# Altium schematic sheet Power Components.SchDoc
size A
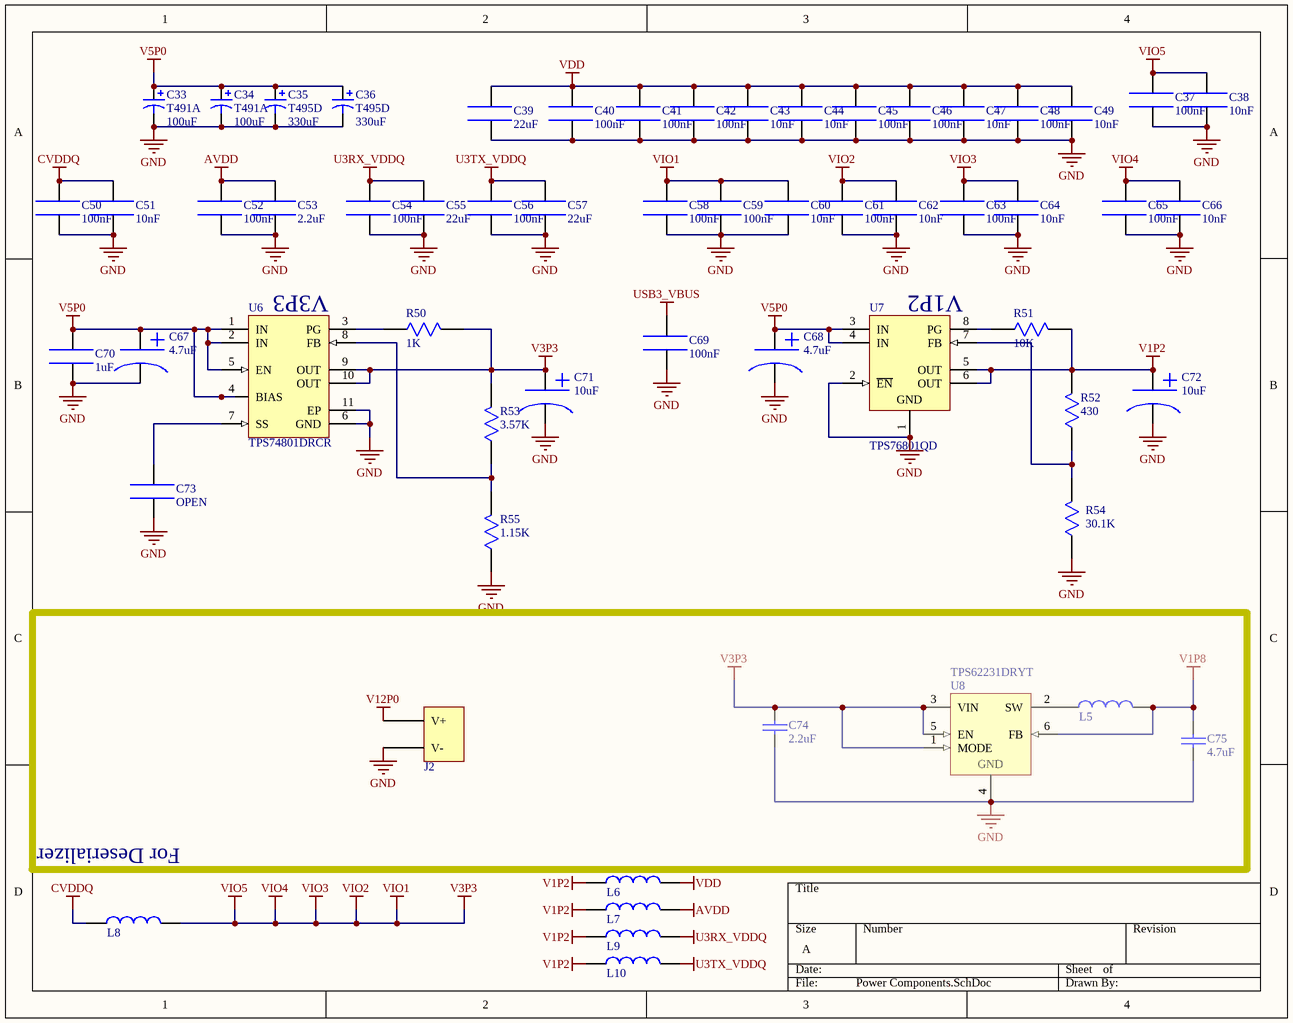
[diagram p0: Power Components.SchDoc]

## Parts
C33  T491A  value 100uF  [A]
C34  T491A  value 100uF  [A]
C35  T495D  value 330uF  [D]
C36  T495D  value 330uF  [D]
C37  value 100nF  [SMD Capacitor 0603]  (hidden comment: Capacitor)
C38  value 10nF  [SMD Capacitor 0603]  (hidden comment: Capacitor)
C39  value 22uF  [SMD Capacitor 0603]  (hidden comment: Capacitor)
C40  value 100nF  [SMD Capacitor 0603]  (hidden comment: Capacitor)
C41  value 100nF  [SMD Capacitor 0603]  (hidden comment: Capacitor)
C42  value 100nF  [SMD Capacitor 0603]  (hidden comment: Capacitor)
C43  value 10nF  [SMD Capacitor 0603]  (hidden comment: Capacitor)
C44  value 10nF  [SMD Capacitor 0603]  (hidden comment: Capacitor)
C45  value 100nF  [SMD Capacitor 0603]  (hidden comment: Capacitor)
C46  value 100nF  [SMD Capacitor 0603]  (hidden comment: Capacitor)
C47  value 10nF  [SMD Capacitor 0603]  (hidden comment: Capacitor)
C48  value 100nF  [SMD Capacitor 0603]  (hidden comment: Capacitor)
C49  value 10nF  [SMD Capacitor 0603]  (hidden comment: Capacitor)
C50  value 100nF  [SMD Capacitor 0603]  (hidden comment: Capacitor)
C51  value 10nF  [SMD Capacitor 0603]  (hidden comment: Capacitor)
C52  value 100nF  [SMD Capacitor 0603]  (hidden comment: Capacitor)
C53  value 2.2uF  [SMD Capacitor 0603]  (hidden comment: Capacitor)
C54  value 100nF  [SMD Capacitor 0603]  (hidden comment: Capacitor)
C55  value 22uF  [SMD Capacitor 0603]  (hidden comment: Capacitor)
C56  value 100nF  [SMD Capacitor 0603]  (hidden comment: Capacitor)
C57  value 22uF  [SMD Capacitor 0603]  (hidden comment: Capacitor)
C58  value 100nF  [SMD Capacitor 0603]  (hidden comment: Capacitor)
C59  value 100nF  [SMD Capacitor 0603]  (hidden comment: Capacitor)
C60  value 10nF  [SMD Capacitor 0603]  (hidden comment: Capacitor)
C61  value 100nF  [SMD Capacitor 0603]  (hidden comment: Capacitor)
C62  value 10nF  [SMD Capacitor 0603]  (hidden comment: Capacitor)
C63  value 100nF  [SMD Capacitor 0603]  (hidden comment: Capacitor)
C64  value 10nF  [SMD Capacitor 0603]  (hidden comment: Capacitor)
C65  value 100nF  [SMD Capacitor 0603]  (hidden comment: Capacitor)
C66  value 10nF  [SMD Capacitor 0603]  (hidden comment: Capacitor)
C67  value 4.7uF  [Capacitor Polarized 0603]  (hidden comment: Capacitor Polarized)
C68  value 4.7uF  [Capacitor Polarized 0603]  (hidden comment: Capacitor Polarized)
C69  value 100nF  [SMD Capacitor 0603]  (hidden comment: Capacitor)
C70  value 1uF  [SMD Capacitor 0603]  (hidden comment: Capacitor)
C71  value 10uF  [Capacitor Polarized 0603]  (hidden comment: Capacitor Polarized)
C72  value 10uF  [Capacitor Polarized 0603]  (hidden comment: Capacitor Polarized)
C73  value OPEN  [SMD Capacitor 0603]  (hidden comment: Capacitor)
C74  2.2uF  [SMD Capacitor 0603]
C75  4.7uF  [SMD Capacitor 0603]
J2  DC-Power Jack  [PCBComponent_1 - duplicate]  (value not drawn)
L5  Ferrite Bead  [LQM21PN2R2MC0D]  (value not drawn)
L6  Ferrite Bead  [MPZ2012S601A]  (value not drawn)
L7  Ferrite Bead  [MPZ2012S601A]  (value not drawn)
L8  Ferrite Bead  [MPZ2012S601A]  (value not drawn)
L9  Ferrite Bead  [MPZ2012S601A]  (value not drawn)
L10  Ferrite Bead  [MPZ2012S601A]  (value not drawn)
R50  value 1K  [SMD Resistor 0603]  (hidden comment: Resistor)
R51  value 10K  [SMD Resistor 0603]  (hidden comment: Resistor)
R52  value 430  [SMD Resistor 0603]  (hidden comment: Resistor)
R53  value 3.57K  [SMD Resistor 0603]  (hidden comment: Resistor)
R54  value 30.1K  [SMD Resistor 0603]  (hidden comment: Resistor)
R55  value 1.15K  [SMD Resistor 0603]  (hidden comment: Resistor)
U6  TPS74801DRCR  [TI-DRC10-2400X1650TP_V]
U7  TPS76801QD  [TI-D8_N]
U8  TPS62231DRYT  [DRY6]

## Blocks framed on the sheet
For Deserializer: C74 C75 J2 L5 U8

## Nets
AVDD: C52.1 C53.1 L7.2
CVDDQ: C50.1 C51.1 L8.1
GND: C33.2 C34.2 C35.2 C36.2 C37.0 C38.0 C39.0 C40.0 C41.0 C42.0 C43.0 C44.0 C45.0 C46.0 C47.0 C48.0 C49.0 C50.0 C51.0 C52.0 C53.0 C54.0 C55.0 C56.0 C57.0 C58.0 C59.0 C60.0 C61.0 C62.0 C63.0 C64.0 C65.0 C66.0 C67.- C68.- C69.0 C70.0 C71.- C72.- C73.0 C74.1 C75.1 J2.V- R54.0 R55.0 U6.6(GND) U6.11(EP) U7.1(GND) U7.2(~{EN}) U8.4(GND)
U3RX_VDDQ: C54.1 C55.1 L9.2
U3TX_VDDQ: C56.1 C57.1 L10.2
USB3_VBUS: C69.1
V1P2: C72.+ L6.1 L7.1 L9.1 L10.1 R51.1 R52.1 U7.5(OUT) U7.6(OUT)
V1P8: C75.0 L5.2 U8.6(FB)
V3P3: C37.1 C38.1 C58.1 C59.1 C60.1 C61.1 C62.1 C63.1 C64.1 C65.1 C66.1 C71.+ C74.0 L8.2 R50.1 R53.1 U6.9(OUT) U6.10(OUT) U8.1(MODE) U8.3(VIN) U8.5(EN)  [also labelled VIO1, VIO2, VIO3, VIO4, VIO5]
V5P0: C33.1 C34.1 C35.1 C36.1 C67.+ C68.+ C70.1 U6.1(IN) U6.2(IN) U6.4(BIAS) U6.5(EN) U7.3(IN) U7.4(IN)
V12P0: J2.V+
VDD: C39.1 C40.1 C41.1 C42.1 C43.1 C44.1 C45.1 C46.1 C47.1 C48.1 C49.1 L6.2
NetC73_1: C73.1 U6.7(SS)
NetL5_1: L5.1 U8.2(SW)
NetR50_0: R50.0 U6.3(PG)
NetR51_0: R51.0 U7.8(PG)
NetR52_0: R52.0 R54.1 U7.7(FB)
NetR53_0: R53.0 R55.1 U6.8(FB)

## Notes on the sheet
- (near U6) V3P3
- (near U7) V1P2

## Library data of the parts
C33 C34 = T491A: Solid Tantalum Chip Capacitor, Standard T491 Series - Industrial Grade; Published: 17-Jul-2002; LatestRevisionDate: 19-Mar-2004; LatestRevisionNote: Silkscreen dimensions re-sized.; DatasheetDocument: Mar-2001; PackageDocument: Mar-2001; PackageReference: A; Publisher: Altium Limited; Code_JEITA: 3216-18; ComponentLink1Description: Manufacturer Link; ComponentLink1URL: http://www.kemet.com/; ComponentLink2Description: Datasheet; ComponentLink2URL: http://www.kemet.com/kemet/web/homepage/kechome.nsf/vapubfilesname/F3102TA.pdf/$file/F3102TA.pdf
C35 C36 = T495D: Solid Tantalum Chip Capacitor, Standard T495 Series - Low ESR, Surge Robust; Published: 17-Jul-2002; LatestRevisionDate: 19-Mar-2004; LatestRevisionNote: Silkscreen dimensions re-sized.; DatasheetDocument: Mar-2001; PackageDocument: Mar-2001; PackageReference: D; Publisher: Altium Limited; Code_JEITA: 7343-31; ComponentLink1Description: Manufacturer Link; ComponentLink1URL: http://www.kemet.com/; ComponentLink2Description: Datasheet; ComponentLink2URL: http://www.kemet.com/kemet/web/homepage/kechome.nsf/vapubfilesname/F3102TA.pdf/$file/F3102TA.pdf
C74 C75 = Capacitor: Value: C?
J2 = DC-Power Jack: pin to pad: V+>1 V->2+3
U6 = TPS74801DRCR: Single Output LDO, 1.5 A, Adjustable 0.8 to 3.6 V Output, 0.8 to 5.5 V Input, with Programmable Soft Start, 10-pin SON (DRC), -40 to 125 degC, Green (RoHS & no Sb/Br); Manufacturer: Texas Instruments; Accuracy(%): 2; Iout(Max)(A): 1.5; Iq(Typ)(mA): 1; Power Good: TRUE; Rating: Catalog; SubFamily: Single Channel LDO; Vdo(Typ)(mV): 60; Vin(Max)(V): 5.5; Vin(Min)(V): 0.8; Vout Adj(Max)(V): 3.6; DatasheetVersion: SBVS074J; PackageVersion: 4204102-3/L; PackageReference: DRC10-2400X1650TP; PackageDescription: 10-Pin Plastic Small Outline, Body 3 x 3 mm, Pitch 0.5 mm; Supplier 1: Digi-Key; Supplier Part Number 1: 296-21563-2-ND; Supplier 2: Digi-Key; Supplier Part Number 2: 296-21563-1-ND; Supplier 3: Digi-Key; Supplier Part Number 3: 296-21563-6-ND; Supplier 4: Newark; Supplier Part Number 4: 30M1868; Supplier 5: Mouser; Supplier Part Number 5: 595-TPS74801DRCR; Eco-Plan: Green (RoHS & no Sb/Br); Vout Adj(Min)(V): 0.8; Mounting Technology: Surface Mount; PartNumber: TPS74801DRCR; ComponentLink1Description: Manufacturer URL; ComponentLink1URL: http://www.ti.com/; ComponentLink2Description: Datasheet; ComponentLink2URL: http://www.ti.com/general/docs/lit/getliterature.tsp?genericPartNumber=TPS74801&fileType=pdf; ComponentLink3Description: Package Specification; ComponentLink3URL: http://www.ti.com/litv/pdf/mpds117k; ComponentLink4Description: URL Link1; ComponentLink4URL: Samples URL:http://www.ti.com/product/tps74801#samples
U7 = TPS76801QD: Single Output Fast Transient Response LDO, 1 A, Adjustable 1.2 to 5.5 V Output, 2.7 to 10 V Input, with Low IQ, 8-pin SOIC (D), -40 to 125 degC, Green (RoHS & no Sb/Br); Manufacturer: Texas Instruments; Accuracy(%): 2; Iout(Max)(A): 1; Iq(Typ)(mA): 0.08; Power Good: TRUE; SubFamily: Single Channel LDO; Vdo(Typ)(mV): 230; Vin(Max)(V): 10; Vin(Min)(V): 2.7; Vout Adj(Max)(V): 5.5; Vout Adj(Min)(V): 1.2; DatasheetVersion: SLVS211L; PackageVersion: 4040047-3/M; PackageReference: D8; PackageDescription: 8-Pin Plastic Small Outline, Body 4.9 x 3.9 mm, Pitch 1.27 mm; Supplier 1: Digi-Key; Supplier Part Number 1: 296-2743-5-ND; Supplier 2: Farnell; Supplier Part Number 2: 8461473; Supplier 3: Mouser; Supplier Part Number 3: 595-TPS76801QD; Eco-Plan: Green (RoHS & no Sb/Br); Mounting Technology: Surface Mount; Code_JEDEC: MS-012; PartNumber: TPS76801QD; ComponentLink1Description: Manufacturer URL; ComponentLink1URL: http://www.ti.com/; ComponentLink2Description: Datasheet; ComponentLink2URL: http://www.ti.com/general/docs/lit/getliterature.tsp?genericPartNumber=TPS76801&fileType=pdf; ComponentLink3Description: Package Specification; ComponentLink3URL: http://www.ti.com/litv/pdf/msoi002j
U8 = TPS62231DRYT: Buck Step Down Regulator with 2.05 to 6 V Input and 1.8 V Output, -40 to 85 degC, 6-Pin SON (DRY), Green (RoHS & no Sb/Br); Manufacturer: Texas Instruments; Duty Cycle(Max)(%): 100; Iout(Max)(A): 0.5; Iq(Typ)(mA): 0.022; Preset Vout(V): 1.8; Rating: Catalog; Regulated Outputs(#): 1; SubFamily: Step-Down Regulator; Switch Current Limit(Typ)(A): 0.84; Synchronous Rectification: TRUE; Vin(Max)(V): 6; Vin(Min)(V): 2.05; DatasheetVersion: SLVS941E; PackageVersion: revF, Dec-2011; PackageReference: DRY6; PackageDescription: 6-Pin Plastic Small Outline No-Lead, 1 x 1.45 x 0.6 mm Body, 0.5 mm Pitch; Supplier 1: Digi-Key; Supplier Part Number 1: 296-24485-2-ND; Supplier 2: Digi-Key; Supplier Part Number 2: 296-24485-1-ND; Supplier 3: Digi-Key; Supplier Part Number 3: 296-24485-6-ND; Supplier 4: Farnell; Supplier Part Number 4: 1735598; Supplier 5: Newark; Supplier Part Number 5: 07R8108; Supplier 6: Mouser; Supplier Part Number 6: 595-TPS62231DRYT; Eco-Plan: Green (RoHS & no Sb/Br); Topology: Buck; Vout(Max)(V): 1.8; Vout(Min)(V): 1.8; Mounting Technology: Surface Mount; PartNumber: TPS62231DRYT; ComponentLink1Description: Datasheet; ComponentLink1URL: http://www.ti.com/general/docs/lit/getliterature.tsp?genericPartNumber=TPS62231&fileType=pdf; ComponentLink2Description: Package Specification; ComponentLink2URL: http://www.ti.com/litv/pdf/mpds221e; ComponentLink3Description: URL Link1; ComponentLink3URL: Samples URL:http://www.ti.com/product/tps62231#samples